# EAGLE design lfoprime-7-25-21--LONG (EAGLE 9.6.2)
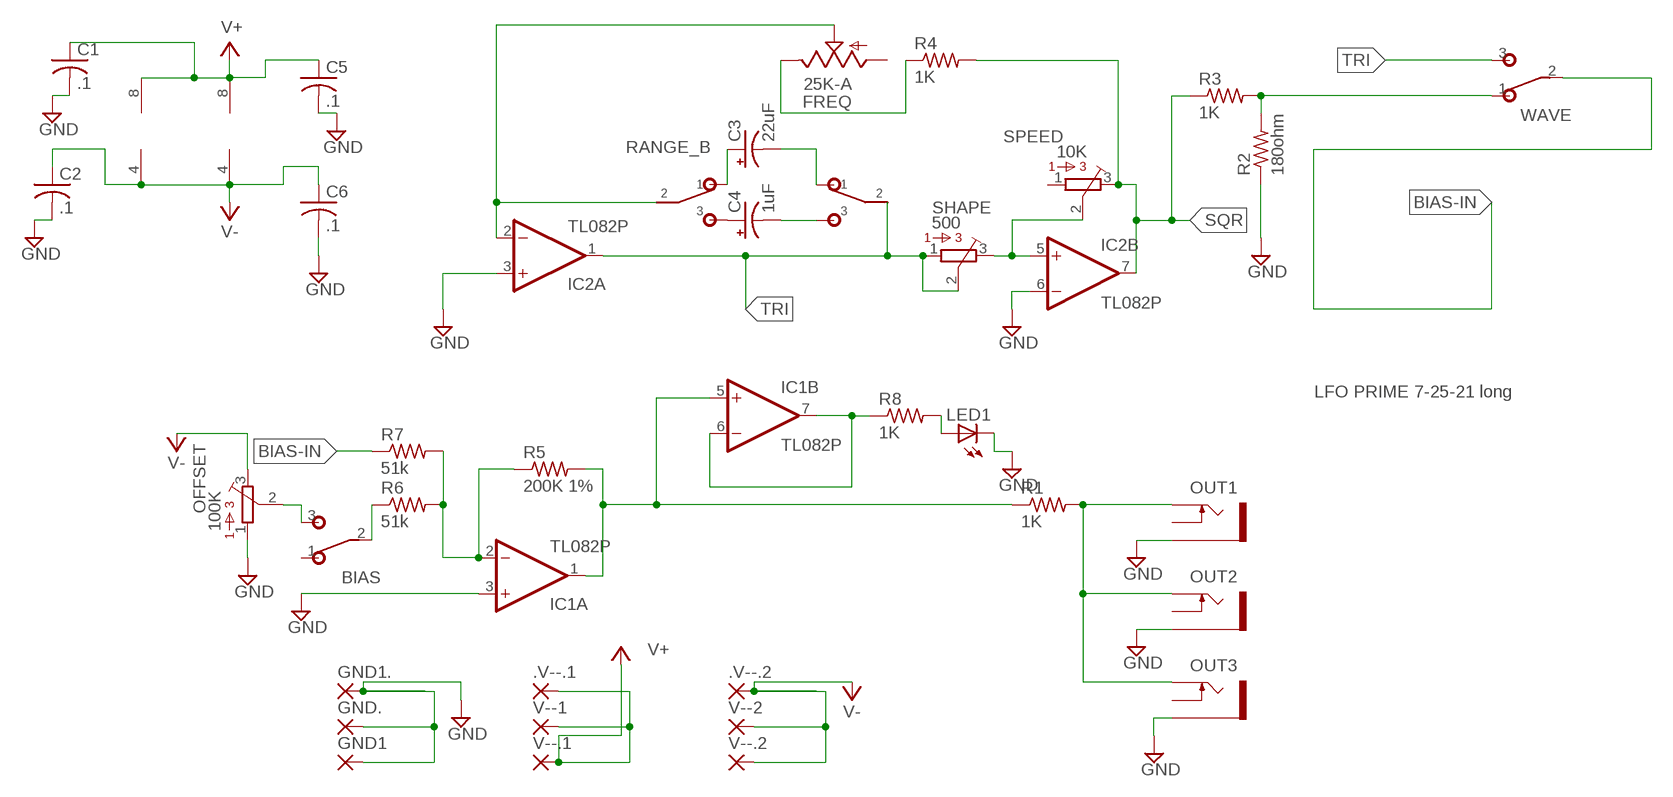
[diagram p0: schematic, sheet 1]

## Parts
.V--.1  3,17/1,3  [3,17/1,3]
.V--.2  3,17/1,3  [3,17/1,3]
BIAS  SPDTPADS  [SPDT]
C1  .1  C-US025-025X050  [C025-025X050]
C2  .1  C-US025-025X050  [C025-025X050]
C3  22uF  CPOL-USE5-4  [E5-4]
C4  1uF  CPOL-USE5-4  [E5-4]
C5  .1  C-US025-025X050  [C025-025X050]
C6  .1  C-US025-025X050  [C025-025X050]
FREQ  25K-A  9MM_SNAP-IN_POT_  [9MM_SNAP-IN_POT]
GND1  3,17/1,3  [3,17/1,3]
GND1.  3,17/1,3  [3,17/1,3]
GND.  3,17/1,3  [3,17/1,3]
IC1  TL082P  [DIL08]
IC2  TL082P  [DIL08]
LED1  LED3MM  [LED3MM]
OFFSET  100K  3362H  [3362H]
OUT1  THONKICONNNEW  [WQP-PJ301M-12_JACK]
OUT2  THONKICONNNEW  [WQP-PJ301M-12_JACK]
OUT3  THONKICONNNEW  [WQP-PJ301M-12_JACK]
R1  1K  R-US_0204/7  [0204/7]
R2  180ohm  R-US_0204/7  [0204/7]
R3  1K  R-US_0204/7  [0204/7]
R4  1K  R-US_0204/7  [0204/7]
R5  200K 1%  R-US_0204/7  [0204/7]
R6  51k  R-US_0204/7  [0204/7]
R7  51k  R-US_0204/7  [0204/7]
R8  1K  R-US_0204/7  [0204/7]
RANGE  DPDT-WIDE  [DPDT-WIDE]
SHAPE  500  3362H  [3362H]
SPEED  10K  3362H  [3362H]
V--1  3,17/1,3  [3,17/1,3]
V--2  3,17/1,3  [3,17/1,3]
V--.1  3,17/1,3  [3,17/1,3]
V--.2  3,17/1,3  [3,17/1,3]
WAVE  SPDTPADS  [SPDT]

## Nets
BIAS-IN: R7.1 WAVE.2(P)
BIAS-OUT: IC1.1(A:OUT) IC1.5(B:+IN) R1.1 R5.2
GND: C1.2 C2.2 C5.2 C6.2 GND1.1(P) GND1..1(P) GND..1(P) IC1.3(A:+IN) IC2.3(A:+IN) IC2.6(B:-IN) LED1.K(C) OFFSET.1 OUT1.P$3_SLEEVE(SLEEVE) OUT2.P$3_SLEEVE(SLEEVE) OUT3.P$3_SLEEVE(SLEEVE) R2.1
N$1: C4.+ RANGE.A3
N$2: C4.- RANGE.B3
N$3: C3.+ RANGE.A1
N$4: C3.- RANGE.B1
N$5: FREQ.2(S) IC2.2(A:-IN) RANGE.A2
N$6: BIAS.3(S) OFFSET.2
N$7: IC2.5(B:+IN) SHAPE.3 SPEED.2
N$8: IC1.2(A:-IN) R5.1 R6.2 R7.2
N$9: IC1.6(B:-IN) IC1.7(B:OUT) R8.1
N$10: OUT1.P$1_TIP(TIP) OUT2.P$1_TIP(TIP) OUT3.P$1_TIP(TIP) R1.2
N$11: FREQ.3(E) R4.1
N$12: LED1.A R8.2
N$13: R2.2 R3.2 WAVE.1(O)
N$14: BIAS.2(P) R6.1
SQR: IC2.7(B:OUT) R3.1 R4.2 SPEED.3
TRI: IC2.1(A:OUT) RANGE.B2 SHAPE.1 SHAPE.2 WAVE.3(S)
V+: .V--.1.1(P) C1.1 C5.1 IC1.8(P:V+) IC2.8(P:V+) V--1.1(P) V--.1.1(P)
V-: .V--.2.1(P) C2.1 C6.1 IC1.4(P:V-) IC2.4(P:V-) OFFSET.3 V--2.1(P) V--.2.1(P)
Unconnected: BIAS.1(O) FREQ.1(A) OUT1.P$2_SWITCH(SWITCH) OUT2.P$2_SWITCH(SWITCH) OUT3.P$2_SWITCH(SWITCH) SPEED.1

## Notes on the sheet
- LFO PRIME 7-25-21 long

## Library data of the parts
.V--.1 .V--.2 GND1 GND1. GND. V--1 V--2 V--.1 V--.2 = wirepad-NONAMES:3,17/1,3: THROUGH-HOLE PAD
BIAS WAVE = switches:SPDT: TOGGLE SWITCH Marquardt
C1 C2 C5 C6 = adafruit:C-US: CAPACITOR, American symbol
C3 C4 = rcl:CPOL-US: POLARIZED CAPACITOR, American symbol
FREQ = MusicThingModular-CL:9MM_SNAP-IN_POT: 9mm vertical snap-in pot, Alpha / Panasonic style
IC1 IC2 = linear:TL082: OP AMP Data sheet <http://www.ti.com/lit/ds/symlink/tl084a . pdf>; DATA_SHEET: <a href="http://www.ti.com/lit/ds/symlink/tl084a.pdf"> Data sheet </a>
LED1 = adafruit:LED: LED OSRAM: - CHIPLED LG R971, LG N971, LY N971, LG Q971, LY Q971, LO R971, LY R971 LH N974, LH R974 LS Q976, LO Q976, LY Q976 LO Q996 - Hyper CHIPLED LW Q18S LB Q993, LB Q99A, LB R99A - SideLED LS A670, LO A670, LY A670, LG A670, LP A670 LB A673, LV A673, LT A673, LW A673 LH A674 LY A675 LS A676, LA A676, LO A676, LY A676, LW A676 LS A679, LY A679, LG A679 - Hyper Micro SIDELED® LS Y876, LA Y876, LO Y876, LY Y876 LT Y87S - SmartLED LW L88C, LW L88S LB L89C, LB L89S, LG L890 LS L89K, LO L89K, LY L89K LS L896, LA L896, LO L896, LY L896 - TOPLED LS T670, LO T670, LY T670, LG T670, LP T670 LSG T670, LSP T670, LSY T670, LOP T670, LYG T670 LG T671, LOG T671, LSG T671 LB T673, LV T673, LT T673, LW T673 LH T674 LS T676, LA T676, LO T676, LY T676, LB T676, LH T676, LSB T676, LW T676 LB T67C, LV T67C, LT T67C, LS T67K, LO T67K, LY T67K, LW E67C LS E67B, LA E67B, LO E67B, LY E67B, LB E67C, LV E67C, LT E67C LW T67C LS T679, LY T679, LG T679 LS T770, LO T770, LY T770, LG T770, LP T770 LB T773, LV T773, LT T773, LW T773 LH T774 LS E675, LA E675, LY E675, LS T675 LS T776, LA T776, LO T776, LY T776, LB T776 LHGB T686 LT T68C, LB T68C - Hyper Mini TOPLED® LB M676 - Mini TOPLED Santana® LG M470 LS M47K, LO M47K, LY M47K Source: http://www.osram.convergy.de/
OFFSET SHAPE SPEED = bourns:3362: 3362 Series 1/4" Square Trimmer
OUT1-OUT3 = MusicThingModular-CL:THONKICONN: 3.5mm socket for Eurorack modular synths
R1-R8 = rcl:R-US_: RESISTOR, American symbol
RANGE = switches-CL2:DPDT-WIDE

## Board
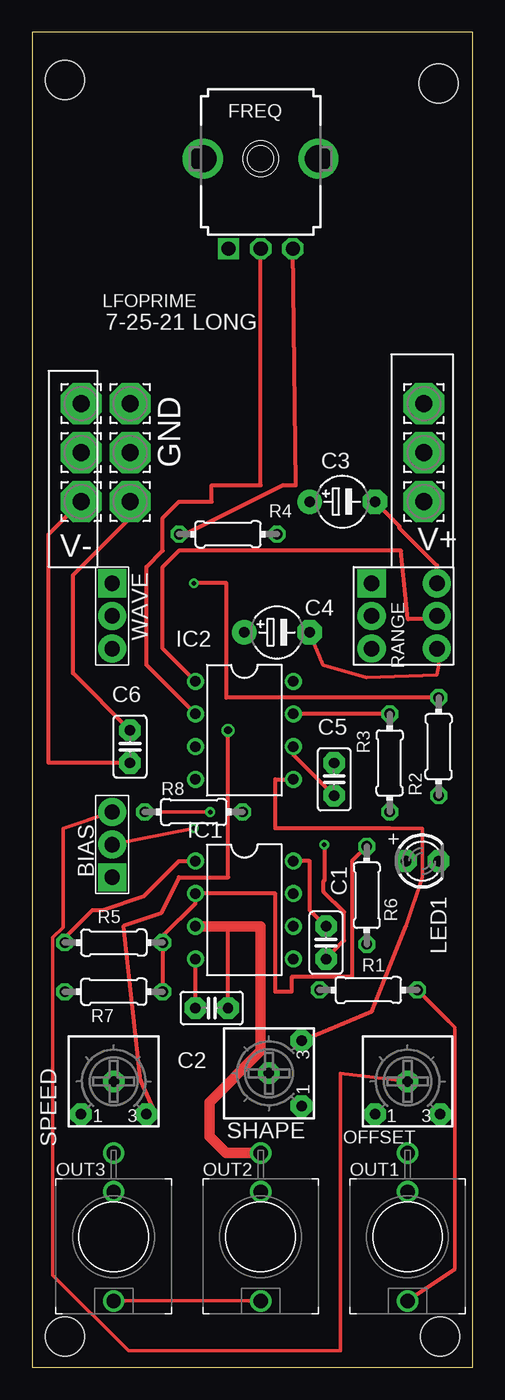
[diagram p1: board, top side]
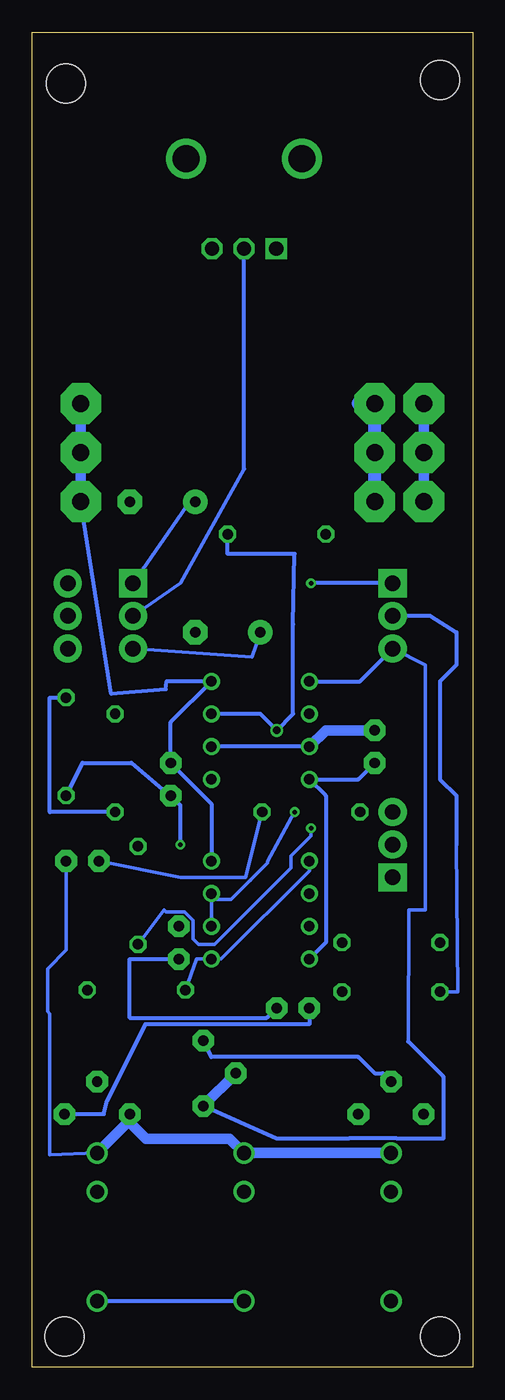
[diagram p2: board, bottom side, seen from below]

Size 34.27 x 103.81 mm. Coordinates in mm from the lower left corner, seen from the top.
Outline: 0,0 34.27,0 34.27,103.81 0,103.81 0,0
Copper layers (1*16): Top 0.035mm / dielectric 1.5mm / Bottom 0.035mm
Design rules "default": minimum track width 6mil, minimum drill 0.35mm, track to track 6mil, track to pad 6mil, pad to pad 6mil, via to via 6mil, smd to smd 6mil, copper to edge 40mil, drill to drill 6mil, minimum pad ring 10mil, minimum via ring 8mil, stop-mask expansion 4mil, vias tented up to drill 0mil, thermal gap 10mil
Holes 3.05 mm at 2.54,2.41 31.75,2.41 2.54,100.08 31.62,99.82

### Footprints (pad centres in the part's own frame; a part is rotated, then mirrored left to right if it is on the bottom)
3,17/1,3 = drill 1.321 pad 3.175 octagon: 1 0,0
SPDT = drill 1.2 pad 2.184 square: 1 -2.54,0 | drill 1.2 pad 2.184: 2 0,0; 3 2.54,0
C025-025X050 = drill 0.813 pad 1.676 octagon: 1 -1.27,0; 2 1.27,0
E5-4 = drill 0.813 pad 1.905: + -2.54,0 | drill 0.813 pad 1.905 octagon: - 2.54,0
9MM_SNAP-IN_POT = drill 1.1 square: 1 -2.5,-7 | drill 1.1 octagon: 2 0,-7; 3 2.5,-7 | drill 2.1 pad 2.794: CHASSIS1 -4.5,0; CHASSIS2 4.5,0
DIL08 = drill 0.813 pad 1.27: 1 -3.81,-3.81; 2 -1.27,-3.81; 3 1.27,-3.81; 4 3.81,-3.81; 5 3.81,3.81; 6 1.27,3.81; 7 -1.27,3.81; 8 -3.81,3.81
LED3MM = drill 0.813 pad 1.676 octagon: A -1.27,0; K 1.27,0
3362H = drill 0.813 pad 1.676 octagon: 1 -2.54,-3.175; 2 0,-0.635; 3 2.54,-3.175
WQP-PJ301M-12_JACK = drill 1.1: P$1_TIP 0,5; P$2_SWITCH 0,-3.5; P$3_SLEEVE 0,-6.5
0204/7 = drill 0.813 octagon: 1 -3.81,0; 2 3.81,0
DPDT-WIDE = drill 1.2 pad 2.184 square: A1 -3.81,2.54 | drill 1.2 pad 2.184: A2 -3.81,0; A3 -3.81,-2.54; B1 1.27,2.54; B2 1.27,0; B3 1.27,-2.54

### Placement (x,y rotation side)
.V--.1  30.48,67.31 0 top
.V--.2  3.81,67.31 0 top
BIAS  6.22,40.64 90 top
C1  22.86,33.02 270 top
C2  13.97,27.94 0 top
C3  24.13,67.31 0 top
C4  19.05,57.15 0 top
C5  23.5,45.72 270 top
C6  7.62,48.26 90 top
FREQ  17.78,93.98 0 top
GND1  7.62,71.12 0 top
GND1.  7.62,74.93 0 top
GND.  7.62,67.31 0 top
IC1  16.51,35.56 270 top
IC2  16.51,49.53 270 top
LED1  30.35,39.37 0 top
OFFSET  29.21,22.86 0 top
OUT1  29.21,10.16 180 top
OUT2  17.78,10.16 180 top
OUT3  6.35,10.16 180 top
R1  26.16,29.34 0 top
R2  31.62,48.26 90 top
R3  27.81,46.99 270 top
R4  15.24,64.77 0 top
R5  6.35,33.02 180 top
R6  26.04,36.7 90 top
R7  6.35,29.21 0 top
R8  12.57,43.18 0 top
RANGE  30.23,58.42 0 top
SHAPE  17.78,22.86 90 top
SPEED  6.35,22.86 0 top
V--1  30.48,71.12 0 top
V--2  3.81,71.12 0 top
V--.1  30.48,74.93 0 top
V--.2  3.81,74.93 0 top
WAVE  6.22,58.42 270 top

### Tracks (layer width: path | path; a pad name or v marks a point on that pad's centre or on a via)
BIAS-IN
  Bottom 0.254: 1.27,40.64 1.14,29.21 R7.1
  Bottom 0.305: WAVE.2 3.3,58.42 1.27,57.15 1.27,54.61 2.54,53.34 2.54,45.72 1.27,44.45 1.27,40.64
BIAS-OUT
  Top 0.305: IC1.1 11.43,39.37 8.73,36.67 5.48,35.56 4.7,35.56 2.54,33.4 R5.2
  Bottom 0.254: R1.1 21.46,31.75 IC1.5 19.56,31.75 12.7,38.61 IC1.1
GND  (via drill 0.35)
  Top 0.305: C6.2 3.17,53.98 3.17,61.59 7.62,66.04 GND..1 | C2.2 15.24,34.29 | C5.2 20.32,47.62 IC2.6 | C1.2 22.86,31.79 24.26,33.18 24.26,35.4 22.67,36.98 22.67,37.83 22.73,37.83 v22.73,40.64
  Top 0.813: OUT2.P$3_SLEEVE 15.09,16.66 13.79,17.96 13.79,20.6 17.78,24.59 17.78,34.29 15.24,34.29 IC1.3
  Bottom 0.254: OUT1.P$3_SLEEVE 32.89,16.51 32.89,27.5 33.07,27.68 33.07,31 31.62,32.44 LED1.K
  Bottom 0.305: 26.67,19.05 OFFSET.1 26.67,19.2 | C2.2 16,27.18 26.67,27.18 26.67,31.75 C1.2 | IC2.3 IC2.6 | v22.73,40.64 22.73,43.69 23.11,44.07 | 23.11,44.07 C5.2 | R2.1 30.35,46.99 26.54,46.99 23.11,44.07
  Bottom 0.813: IC2.3 11.43,49.53 C6.2 | 26.67,19.05 25.4,17.78 18.9,17.78 OUT2.P$3_SLEEVE OUT3.P$3_SLEEVE | OUT1.P$3_SLEEVE 26.67,19.2
  Bottom 1.016: GND..1 GND1.1 7.62,73.66 8.89,74.93 8.25,75.56 GND1..1
N$1
  Bottom 0.254: RANGE.A3 17.15,55.22 C4.+
N$2
  Top 0.254: C4.- 22.61,54.59 25.99,53.62 31.5,53.85 31.62,54.61 RANGE.B3
N$3
  Bottom 0.305: C3.+ 22.28,66.93 RANGE.A1
N$4
  Top 0.305: RANGE.B1 31.5,62.35 28.59,65.26 28.59,65.39 C3.-
N$5
  Top 0.305: FREQ.2 17.78,68.58 13.97,68.58 13.97,67.31 11.43,67.31 10.16,66.04 10.16,63.5 8.89,62.23 8.89,54.61 IC2.2
  Bottom 0.254: RANGE.A2 22.73,60.96 17.78,69.85
  Bottom 0.305: 17.78,69.85 FREQ.2
N$6
  Top 0.254: OFFSET.2 24,22.86 24,1.27 7.49,1.27 1.6,7.16 1.6,33.41 2.41,34.22 2.41,41.91 BIAS.3
N$7
  Top 0.254: 29.08,34.29 30.35,38.1 30.35,41.91 27.81,41.91
  Top 0.305: SHAPE.3 26.44,27.69 | 26.44,27.69 | 26.44,27.69 29.08,34.29 | 27.81,41.91 18.92,41.91 18.92,45.72 IC2.5
  Bottom 0.305: SPEED.2 6.99,22.86 7.62,22.86 8.89,24.13 20.32,24.13 SHAPE.3
N$8
  Top 0.305: R7.2 R5.1 10.16,33.53 12.7,36.07 IC1.2 18.92,36.83 18.92,29.21 20.19,29.21 20.19,30.35 24.89,30.35 24.89,39.37 R6.2
N$9  (via drill 0.35)
  Top 0.254: v13.84,43.18 R8.1
  Bottom 0.254: IC1.6 IC1.7 19.89,36.4 18.78,36.4 17.4,37.78 17.3,37.84 17.29,37.89 15.98,39.2 15.98,39.32 v13.84,43.18
N$10
  Top 0.254: 32.38,26.92 32.87,26.44 32.87,7.64 32.89,7.62 OUT1.P$1_TIP | OUT2.P$1_TIP OUT3.P$1_TIP
  Top 0.305: R1.2 32.38,26.92
  Bottom 0.305: OUT1.P$1_TIP OUT2.P$1_TIP
N$11
  Top 0.305: R4.1 11.94,64.77 19.56,68.58 20.51,68.58 FREQ.3
N$12
  Bottom 0.254: LED1.A 22.73,38.1 17.65,38.1 R8.2
N$13  (via drill 0.35)
  Top 0.305: R2.2 15.11,52.07 15.11,60.96 v12.57,60.96
  Bottom 0.305: R3.2 32.89,43.18 32.89,52.07 R2.2 | WAVE.1 v12.57,60.96
N$14  (via drill 0.35)
  Top 0.254: v12.57,41.91 BIAS.2
  Bottom 0.254: R6.1 24,35.56 23.85,35.41 22.4,35.41 21.74,34.75 21.74,33.3 21.34,32.89 20.07,32.89 14.15,38.81 14.15,39.76 12.57,41.33 v12.57,41.91
SQR  (via drill 0.6)
  Top 0.305: SPEED.3 9.38,20.17 8.44,22.28 7.12,34.3 10.03,35.3 11.43,38.1 15.24,38.1 v15.24,49.53 | R3.1 IC2.7
  Bottom 0.305: R4.2 19.05,63.25 13.84,63.25 13.97,57.78 13.97,50.8 v15.24,49.53 16.51,50.8 IC2.7
TRI
  Top 0.305: IC2.1 10.16,55.88 10.16,62.23 11.43,63.5 28.7,63.5 29.23,58.17 31.24,58.17 RANGE.B2
  Bottom 0.254: 5.02,25.34 4.95,35.56 3.68,35.56 3.68,54.61 WAVE.3
  Bottom 0.305: IC2.1 8.76,53.34 WAVE.3 | 5.02,25.34 2.29,22.61 2.29,17.78 5.87,17.78 5.88,17.79 9.64,17.79 9.63,17.78 15.24,17.78 SHAPE.1
  Bottom 0.813: SHAPE.1 SHAPE.2
V+
  Top 0.305: C1.1 21.59,35.56 21.59,39.37 IC1.8
  Bottom 0.305: IC1.8 20.32,43.81 C5.1 23.5,50.16 IC2.8 23.79,53.34 23.88,52.7 28.11,52.37 .V--.1.1
  Bottom 0.813: V--.1.1 V--1.1 .V--.1.1
V-
  Top 0.305: C6.1 1.27,46.99 1.27,64.77 .V--.2.1 | C2.1 IC1.4
  Bottom 0.305: C6.1 8.89,45.72 IC2.4 11.43,44.45 11.43,33.02 IC1.4 | C2.1 12.7,26.67 25.46,26.67 28.45,20.7 28.7,19.68 OFFSET.3
  Bottom 0.813: V--.2.1 V--2.1 .V--.2.1

### Text on the board
tNames: LFOPRIME | 7-25-21 LONG | GND | V+ | V-